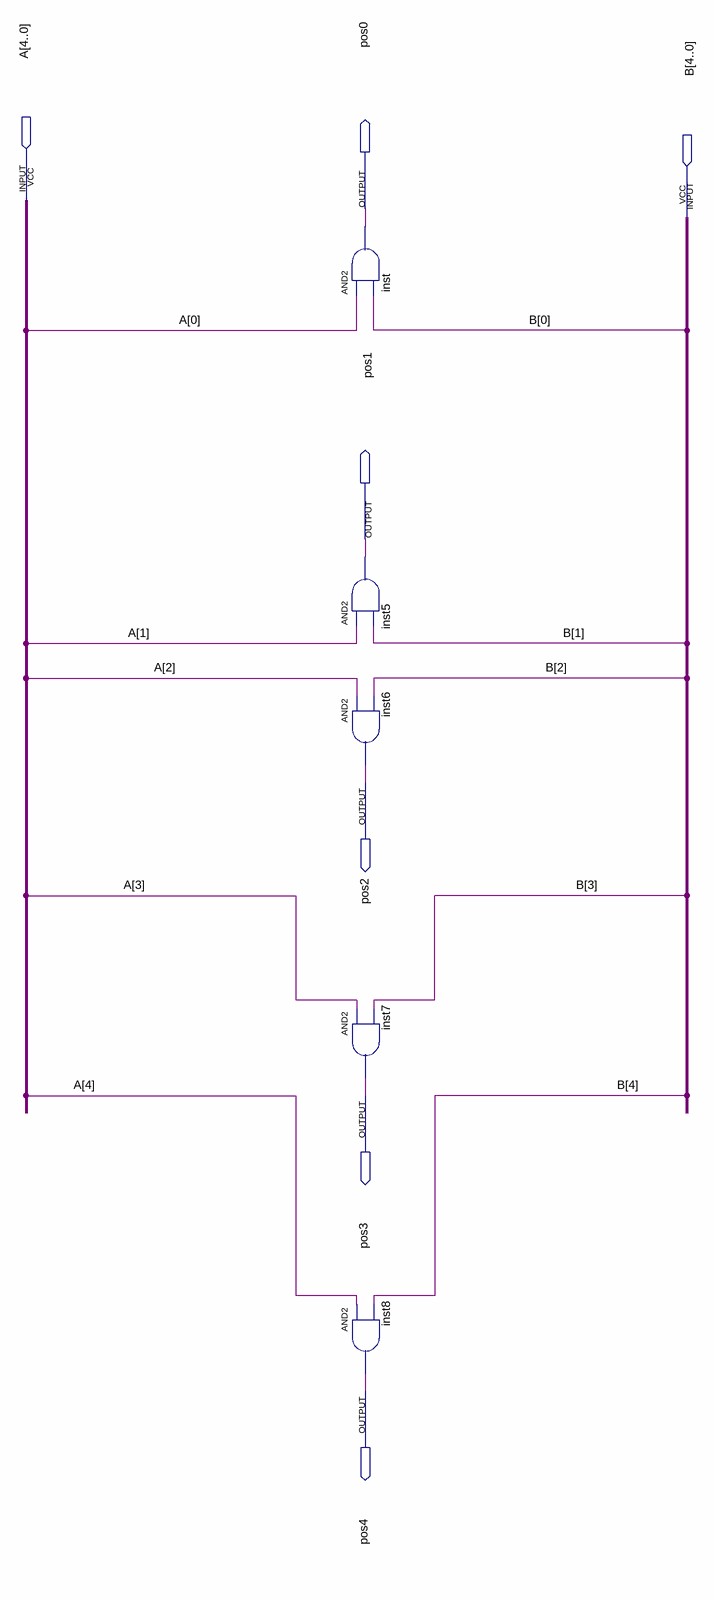
[diagram p0: schematic sheet]
// Quartus schematic andvetores.bdf as structural Verilog: 5 symbols, 7 pins
module andvetores (
  input  [4:0] A,
  input  [4:0] B,
  output pos0,
  output pos1,
  output pos2,
  output pos3,
  output pos4
);

  and inst (pos0, A[0], B[0]);
  and inst5 (pos1, A[1], B[1]);
  and inst6 (pos2, A[2], B[2]);
  and inst7 (pos3, A[3], B[3]);
  and inst8 (pos4, A[4], B[4]);
endmodule
